# Altium schematic sheet Power_Section.SchDoc
size C
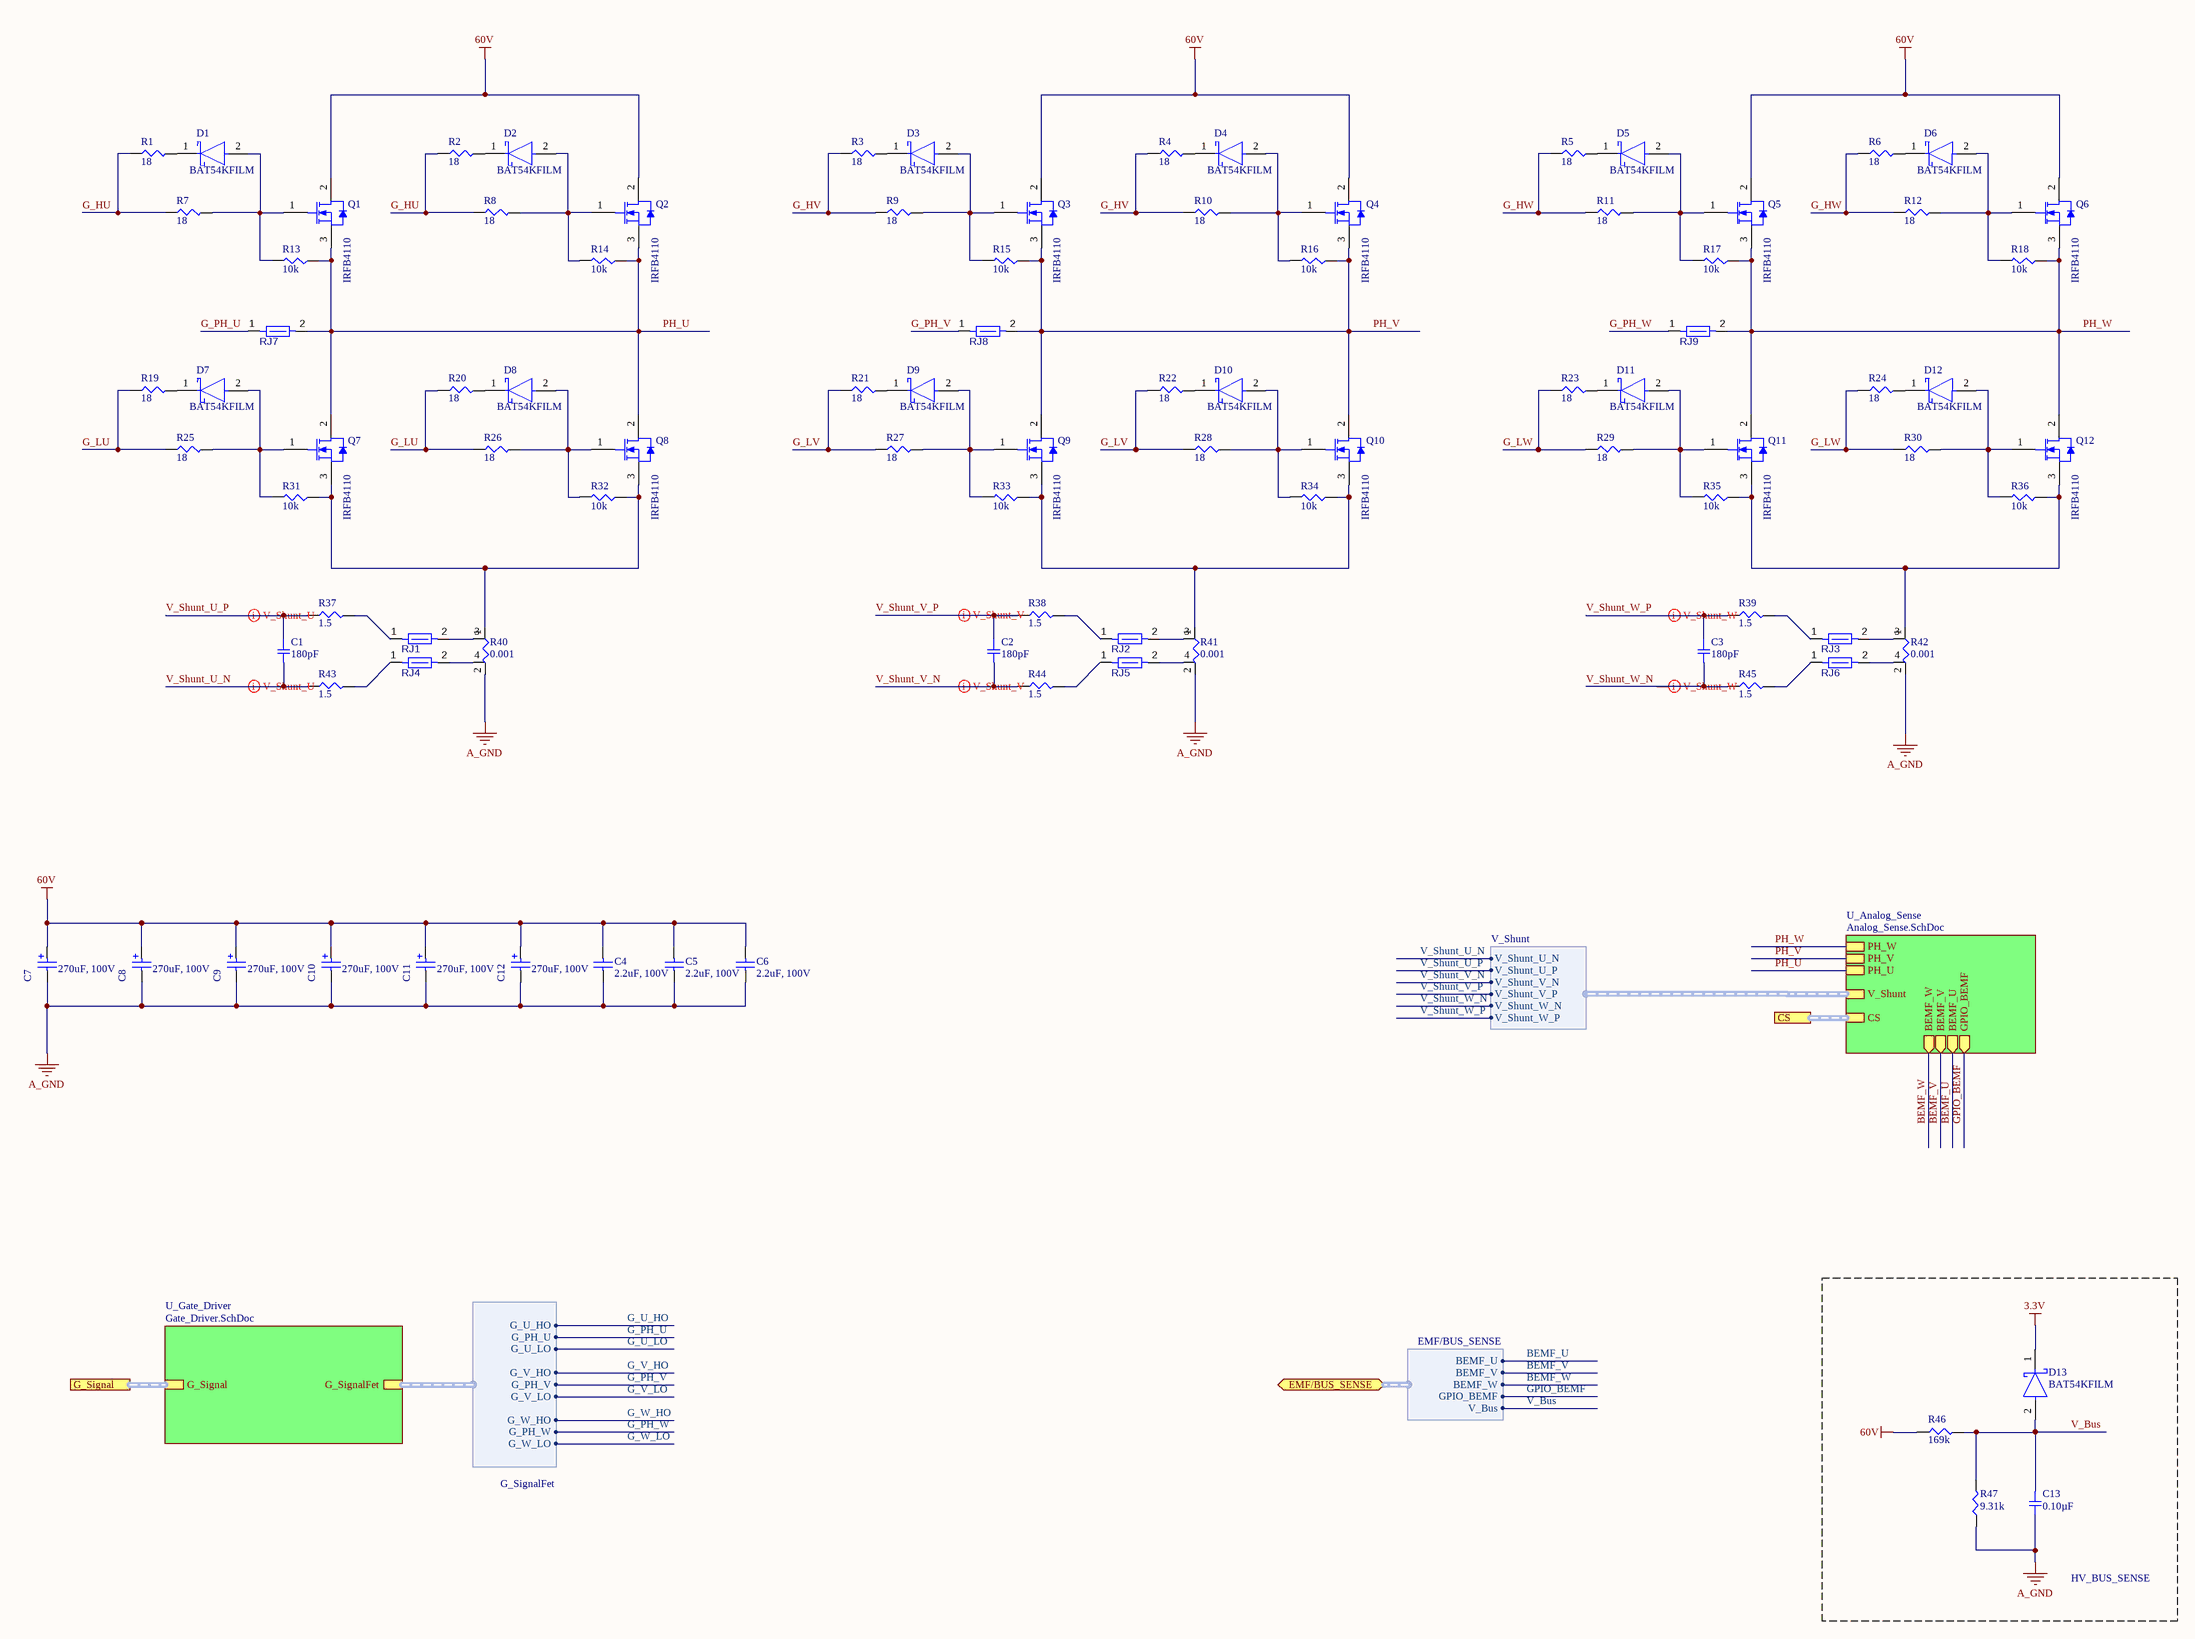
[diagram p0: Power_Section.SchDoc]

## Parts
C1  180pF  [SMD-0805C]
C2  180pF  [SMD-0805C]
C3  180pF  [SMD-0805C]
C4  2.2uF, 100V  [L18_W8.5_H15_P15]
C5  2.2uF, 100V  [L18_W8.5_H15_P15]
C6  2.2uF, 100V  [L18_W8.5_H15_P15]
C7  270uF, 100V  [WCAP-ATUL_16x25]
C8  270uF, 100V  [WCAP-ATUL_16x25]
C9  270uF, 100V  [WCAP-ATUL_16x25]
C10  270uF, 100V  [WCAP-ATUL_16x25]
C11  270uF, 100V  [WCAP-ATUL_16x25]
C12  270uF, 100V  [WCAP-ATUL_16x25]
C13  0.10µF  [SMD-0805C]
D1  BAT54KFILM  [FP-SOD-523-MFG]
D2  BAT54KFILM  [FP-SOD-523-MFG]
D3  BAT54KFILM  [FP-SOD-523-MFG]
D4  BAT54KFILM  [FP-SOD-523-MFG]
D5  BAT54KFILM  [FP-SOD-523-MFG]
D6  BAT54KFILM  [FP-SOD-523-MFG]
D7  BAT54KFILM  [FP-SOD-523-MFG]
D8  BAT54KFILM  [FP-SOD-523-MFG]
D9  BAT54KFILM  [FP-SOD-523-MFG]
D10  BAT54KFILM  [FP-SOD-523-MFG]
D11  BAT54KFILM  [FP-SOD-523-MFG]
D12  BAT54KFILM  [FP-SOD-523-MFG]
D13  BAT54KFILM  [FP-SOD-523-MFG]
Q1  IRFB4110  [TO-220-3_Horizontal_TabUp]
Q2  IRFB4110  [TO-220-3_Horizontal_TabUp]
Q3  IRFB4110  [TO-220-3_Horizontal_TabUp]
Q4  IRFB4110  [TO-220-3_Horizontal_TabUp]
Q5  IRFB4110  [TO-220-3_Horizontal_TabUp]
Q6  IRFB4110  [TO-220-3_Horizontal_TabUp]
Q7  IRFB4110  [TO-220-3_Horizontal_TabUp]
Q8  IRFB4110  [TO-220-3_Horizontal_TabUp]
Q9  IRFB4110  [TO-220-3_Horizontal_TabUp]
Q10  IRFB4110  [TO-220-3_Horizontal_TabUp]
Q11  IRFB4110  [TO-220-3_Horizontal_TabUp]
Q12  IRFB4110  [TO-220-3_Horizontal_TabUp]
R1  18  [SMD-0805-RES]
R2  18  [SMD-0805-RES]
R3  18  [SMD-0805-RES]
R4  18  [SMD-0805-RES]
R5  18  [SMD-0805-RES]
R6  18  [SMD-0805-RES]
R7  18  [SMD-0805-RES]
R8  18  [SMD-0805-RES]
R9  18  [SMD-0805-RES]
R10  18  [SMD-0805-RES]
R11  18  [SMD-0805-RES]
R12  18  [SMD-0805-RES]
R13  10k  [SMD-0805-RES]
R14  10k  [SMD-0805-RES]
R15  10k  [SMD-0805-RES]
R16  10k  [SMD-0805-RES]
R17  10k  [SMD-0805-RES]
R18  10k  [SMD-0805-RES]
R19  18  [SMD-0805-RES]
R20  18  [SMD-0805-RES]
R21  18  [SMD-0805-RES]
R22  18  [SMD-0805-RES]
R23  18  [SMD-0805-RES]
R24  18  [SMD-0805-RES]
R25  18  [SMD-0805-RES]
R26  18  [SMD-0805-RES]
R27  18  [SMD-0805-RES]
R28  18  [SMD-0805-RES]
R29  18  [SMD-0805-RES]
R30  18  [SMD-0805-RES]
R31  10k  [SMD-0805-RES]
R32  10k  [SMD-0805-RES]
R33  10k  [SMD-0805-RES]
R34  10k  [SMD-0805-RES]
R35  10k  [SMD-0805-RES]
R36  10k  [SMD-0805-RES]
R37  1.5  [SMD-0805-RES]
R38  1.5  [SMD-0805-RES]
R39  1.5  [SMD-0805-RES]
R40  0.001  [SMD-2512-RES]
R41  0.001  [SMD-2512-RES]
R42  0.001  [SMD-2512-RES]
R43  1.5  [SMD-0805-RES]
R44  1.5  [SMD-0805-RES]
R45  1.5  [SMD-0805-RES]
R46  169k  [SMD-0805-RES]
R47  9.31k  [SMD-0805-RES]
RJ1  Net Tie 12x8mil  [SHORT06-FP]  (value not drawn)  (net tie, no BOM)
RJ2  Net Tie 12x8mil  [SHORT06-FP]  (value not drawn)  (net tie, no BOM)
RJ3  Net Tie 12x8mil  [SHORT06-FP]  (value not drawn)  (net tie, no BOM)
RJ4  Net Tie 12x8mil  [SHORT06-FP]  (value not drawn)  (net tie, no BOM)
RJ5  Net Tie 12x8mil  [SHORT06-FP]  (value not drawn)  (net tie, no BOM)
RJ6  Net Tie 12x8mil  [SHORT06-FP]  (value not drawn)  (net tie, no BOM)
RJ7  Net Tie 12x8mil  [SHORT06-FP]  (value not drawn)  (net tie, no BOM)
RJ8  Net Tie 12x8mil  [SHORT06-FP]  (value not drawn)  (net tie, no BOM)
RJ9  Net Tie 12x8mil  [SHORT06-FP]  (value not drawn)  (net tie, no BOM)

## Blocks framed on the sheet
HV_BUS_SENSE: C13 D13 R46 R47

## Sub-sheets
U_Analog_Sense = Analog_Sense.SchDoc: PH_W, PH_U, PH_V, CS (harness CS), BEMF_W (out), BEMF_V (out), BEMF_U (out), GPIO_BEMF (out), V_Shunt (harness V_Shunt)
U_Gate_Driver = Gate_Driver.SchDoc: G_Signal (harness G_Signal), G_SignalFet (harness G_SignalFet)

## Ports
CS (harness CS), EMF/BUS_SENSE (bidir, harness EMF/BUS_SENSE), G_Signal (harness G_Signal)

## Harnesses
G_SignalFet: G_V_HO, G_PH_V, G_V_LO, G_PH_W, G_U_HO, G_PH_U, G_U_LO, G_W_HO, G_W_LO
EMF/BUS_SENSE: BEMF_U, BEMF_V, BEMF_W, GPIO_BEMF, V_Bus
V_Shunt: V_Shunt_U_N, V_Shunt_U_P, V_Shunt_V_N, V_Shunt_V_P, V_Shunt_W_N, V_Shunt_W_P

## Nets
3.3V: D13.1(C)
60V: C4.2 C5.2 C6.2 C7.2(P) C8.2(P) C9.2(P) C10.2(P) C11.2(P) C12.2(P) Q1.2(DRAIN) Q2.2(DRAIN) Q3.2(DRAIN) Q4.2(DRAIN) Q5.2(DRAIN) Q6.2(DRAIN) R46.1
A_GND: C4.1 C5.1 C6.1 C7.1(N) C8.1(N) C9.1(N) C10.1(N) C11.1(N) C12.1(N) C13.2 R40.2 R41.2 R42.2 R47.1
BEMF_U: sheet U_Analog_Sense/BEMF_U, port EMF/BUS_SENSE.BEMF_U
BEMF_V: sheet U_Analog_Sense/BEMF_V, port EMF/BUS_SENSE.BEMF_V
BEMF_W: sheet U_Analog_Sense/BEMF_W, port EMF/BUS_SENSE.BEMF_W
G_HU: R1.1 R2.1 R7.1 R8.1
G_HV: R3.1 R4.1 R9.1 R10.1
G_HW: R5.1 R6.1 R11.1 R12.1
G_LU: R19.1 R20.1 R25.1 R26.1
G_LV: R21.1 R22.1 R27.1 R28.1
G_LW: R23.1 R24.1 R29.1 R30.1
G_PH_U: RJ7.1 ; sheet U_Gate_Driver/G_SignalFet.G_PH_U
G_PH_V: RJ8.1 ; sheet U_Gate_Driver/G_SignalFet.G_PH_V
G_PH_W: RJ9.1 ; sheet U_Gate_Driver/G_SignalFet.G_PH_W
G_U_HO: sheet U_Gate_Driver/G_SignalFet.G_U_HO
G_U_LO: sheet U_Gate_Driver/G_SignalFet.G_U_LO
G_V_HO: sheet U_Gate_Driver/G_SignalFet.G_V_HO
G_V_LO: sheet U_Gate_Driver/G_SignalFet.G_V_LO
G_W_HO: sheet U_Gate_Driver/G_SignalFet.G_W_HO
G_W_LO: sheet U_Gate_Driver/G_SignalFet.G_W_LO
GPIO_BEMF: sheet U_Analog_Sense/GPIO_BEMF, port EMF/BUS_SENSE.GPIO_BEMF
PH_U: Q1.3(SOURCE) Q2.3(SOURCE) Q7.2(DRAIN) Q8.2(DRAIN) R13.1 R14.1 RJ7.2 ; sheet U_Analog_Sense/PH_U
PH_V: Q3.3(SOURCE) Q4.3(SOURCE) Q9.2(DRAIN) Q10.2(DRAIN) R15.1 R16.1 RJ8.2 ; sheet U_Analog_Sense/PH_V
PH_W: Q5.3(SOURCE) Q6.3(SOURCE) Q11.2(DRAIN) Q12.2(DRAIN) R17.1 R18.1 RJ9.2 ; sheet U_Analog_Sense/PH_W
V_Bus: C13.1 D13.2(A) R46.2 R47.2 ; port EMF/BUS_SENSE.V_Bus
V_Shunt_U_N: C1.2 R43.1 ; sheet U_Analog_Sense/V_Shunt.V_Shunt_U_N
V_Shunt_U_P: C1.1 R37.1 ; sheet U_Analog_Sense/V_Shunt.V_Shunt_U_P
V_Shunt_V_N: C2.2 R44.1 ; sheet U_Analog_Sense/V_Shunt.V_Shunt_V_N
V_Shunt_V_P: C2.1 R38.1 ; sheet U_Analog_Sense/V_Shunt.V_Shunt_V_P
V_Shunt_W_N: C3.2 R45.1 ; sheet U_Analog_Sense/V_Shunt.V_Shunt_W_N
V_Shunt_W_P: C3.1 R39.1 ; sheet U_Analog_Sense/V_Shunt.V_Shunt_W_P
NetD1_1: D1.1(C) R1.2
NetD1_2: D1.2(A) Q1.1(GATE) R7.2 R13.2
NetD2_1: D2.1(C) R2.2
NetD2_2: D2.2(A) Q2.1(GATE) R8.2 R14.2
NetD3_1: D3.1(C) R3.2
NetD3_2: D3.2(A) Q3.1(GATE) R9.2 R15.2
NetD4_1: D4.1(C) R4.2
NetD4_2: D4.2(A) Q4.1(GATE) R10.2 R16.2
NetD5_1: D5.1(C) R5.2
NetD5_2: D5.2(A) Q5.1(GATE) R11.2 R17.2
NetD6_1: D6.1(C) R6.2
NetD6_2: D6.2(A) Q6.1(GATE) R12.2 R18.2
NetD7_1: D7.1(C) R19.2
NetD7_2: D7.2(A) Q7.1(GATE) R25.2 R31.2
NetD8_1: D8.1(C) R20.2
NetD8_2: D8.2(A) Q8.1(GATE) R26.2 R32.2
NetD9_1: D9.1(C) R21.2
NetD9_2: D9.2(A) Q9.1(GATE) R27.2 R33.2
NetD10_1: D10.1(C) R22.2
NetD10_2: D10.2(A) Q10.1(GATE) R28.2 R34.2
NetD11_1: D11.1(C) R23.2
NetD11_2: D11.2(A) Q11.1(GATE) R29.2 R35.2
NetD12_1: D12.1(C) R24.2
NetD12_2: D12.2(A) Q12.1(GATE) R30.2 R36.2
NetQ7_3: Q7.3(SOURCE) Q8.3(SOURCE) R31.1 R32.1 R40.1
NetQ9_3: Q9.3(SOURCE) Q10.3(SOURCE) R33.1 R34.1 R41.1
NetQ11_3: Q11.3(SOURCE) Q12.3(SOURCE) R35.1 R36.1 R42.1
NetR37_2: R37.2 RJ1.1
NetR38_2: R38.2 RJ2.1
NetR39_2: R39.2 RJ3.1
NetR40_3: R40.3 RJ1.2
NetR40_4: R40.4 RJ4.2
NetR41_3: R41.3 RJ2.2
NetR41_4: R41.4 RJ5.2
NetR42_3: R42.3 RJ3.2
NetR42_4: R42.4 RJ6.2
NetR43_2: R43.2 RJ4.1
NetR44_2: R44.2 RJ5.1
NetR45_2: R45.2 RJ6.1

## Buses and harness runs
harness port CS = sheet U_Analog_Sense/CS
harness port G_Signal = sheet U_Gate_Driver/G_Signal

## Layout directives
differential pair: V_Shunt_U_N, V_Shunt_U_P, V_Shunt_V_N, V_Shunt_V_P, V_Shunt_W_N, V_Shunt_W_P

## Library data of the parts
C1-C3 = GQM2195C2A181GB12D: CAP CER 180PF 100V NP0 0805; Manufacturer: Murata Electronics North America; Factory Stock: 0; Unit Price (USD): 1.44; Minimum Quantity: 1; Tolerance: ±2%; Temperature Coefficient: C0G, NP0; Datasheets: http://www.murata.com/~/media/webrenewal/support/library/catalog/products/capacitor/mlcc/c02e.pdf; Image: //media.digikey.com/Renders/Murata%20Renders/0805(GxM9).jpg; Digi-Key Part Number: 490-7180-1-ND; Part Number: GQM2195C2A181GB12D; Quantity Available: 7523; @ qty: 0; Packaging: Cut Tape (CT); Series: GQM; Part Status: Active; Value: 180pF; Voltage: 100V; Operating Temperature: -55°C ~ 125°C; Features: High Q, Low Loss; Ratings: -; Applications: RF, Microwave, High Frequency; Mounting Type: Surface Mount, MLCC; Package / Case: 0805 (2012 Metric); Size / Dimension: 0.079" L x 0.049" W (2.01mm x 1.25mm); Height - Seated (Max): -; Thickness (Max): 0.037" (0.95mm); Lead Spacing: -; Lead Style: -
C4-C6 = 890263425004CS: WCAP-FTBE THT Film Capacitors, 2.2uF, 100VDC; Insulation Resistance: 3000Ohm x F; Dissipation Factor@100kHz: 5%; Dissipation Factor@1kHz: 1%; Dissipation Factor@10kHz: 1.6%; Pitch: 15mm; Rate of Voltage Rise: 9V/us; Technical Reference: MPSP015225K100DCPP45004; ComponentLink1Description: Manufacturer; ComponentLink1URL: http://www.we-online.de; ComponentLink2Description: Datasheet; ComponentLink2URL: https://katalog.we-online.com/pbs/datasheet/890263425004CS.pdf; Length: 18mm; Mounting Technology: THT; Packaging: Carton; Part Number: 890263425004CS; Operating Temperature: -40 to +85degC; Width: 8.5mm; Capacitance: 2.2uF; Height: 15mm; Rated Voltage: 100VDC; Publisher: Wurth Elektronik; Published Date: August 2019
C7-C12 = 860040880007: WCAP-ATUL THT Aluminum Electrolytic Capacitors, D16mm x L25mm, 270uF, +/-20%, 100VDC; Dissipation Factor: 9%; Endurance: 10000h; Leakage Current: 270uA; Ripple Current max.: 1480mA; Technical Reference: ATDK250271M100DSPAEK000; ComponentLink1Description: Manufacturer; ComponentLink1URL: http://www.we-online.de; ComponentLink2Description: Datasheet; ComponentLink2URL: https://katalog.we-online.com/pbs/datasheet/860040880007.pdf; Length: 25mm; Mounting Technology: THT; Operating Temperature: -40 to +105degC; Packaging: Ammo Pack; Published Date: August 2019; Capacitance: 270uF; Diameter: 16mm; Part Number: 860040880007; Publisher: Wurth Elektronik; Capacitance Tolerance: +/-20%; Rated Voltage: 100VDC
C13 = GCD21BR71H104KA01L: CAP CER 0.1UF 50V X7R 0805; Manufacturer: Murata Electronics North America; Factory Stock: 0; Unit Price (USD): 0.24; Minimum Quantity: 1; Tolerance: ±10%; Datasheets: http://www.murata.com/~/media/webrenewal/support/library/catalog/products/capacitor/mlcc/c03e.ashx; Image: //media.digikey.com/Renders/Murata%20Renders/0805%28GxM6%29.jpg; Digi-Key Part Number: 490-11955-1-ND; Part Number: GCD21BR71H104KA01L; Quantity Available: 157; @ qty: 0; Packaging: Cut Tape (CT); Series: GCD; Part Status: Active; Value: 0.10µF; Voltage: 50V; Temperature Coefficient: X7R; Operating Temperature: -55°C ~ 125°C; Features: -; Ratings: AEC-Q200; Applications: Automotive; Mounting Type: Surface Mount, MLCC; Package / Case: 0805 (2012 Metric); Size / Dimension: 0.079" L x 0.049" W (2.00mm x 1.25mm); Height - Seated (Max): -; Thickness (Max): 0.049" (1.25mm); Lead Spacing: -; Lead Style: -
D1-D13 = CMP-12187-000026-1: DIODE SCHOTTKY 40V 300MA SOD523; Manufacturer: STMicroelectronics; Capacitance: 7pF; Value: 7pF; Max Surge Forward Current: 1.25A; Peak Reverse Current: 1uA; Max Junction Temp: +150°C; Device Class L2: Diodes; Temperature Range Low: -40°C; Category: Diode; Manufacturer Part Number: BAT54KFILM; Digikey Description: DIODE SCHOTTKY 40V 300MA SOD523; Device Class L3: Schottky Diodes; Automotive: No; Height: 0.7mm; Octopart: https://octopart.com/bat54kfilm-stmicroelectronics-39618022; ComponentLink2Description: Datasheet; Temperature Range High: +150°C; Device Class L1: Discrete Semiconductors; Max Repetitive Reverse Voltage: 40V; RoHS: TRUE; Temperature: -40°C to +150°C; ComponentLink2URL: https://www.st.com/content/ccc/resource/technical/document/datasheet/07/50/54/f2/0d/ba/4a/79/CD00001322.pdf/files/CD00001322.pdf/jcr:content/translations/en.CD00001322.pdf; Lead Free: Yes; Forward Current: 300mA; Package: SOD-523; Mouser Description: Schottky Diodes & Rectifiers schottky diode
Q1-Q12 = CUSTOM-MOS: 100V 120A; PartNumber: IPW65R110CFDA; Manufacturer: Infineon; QG: 118Â nC; Green: TRUE; Ptot (max): 277.8Â W; VGS(th) (max): 4.5Â V; VDS (max): 650Â V; RthJA (max): 62Â K/W; IDpuls (max): 99.6Â A; RDS (on) (max): 110Â mOhm; VGS(th) (min): 3.5Â V; Rth: 0.45Â K/W; Packing: Tube; ID (max): 31.2Â A; Polarity: N; ComponentLink1Description: Manufacturer URL; ComponentLink3Description: Package Specification; DatasheetVersion: Rev. 2.0; PackageDescription: 3-Pin Plastic (Green) Transistor Single Outline Package, 15.94 x 20.95 mm Body, 5.44 mm Pitch; Halogen-free: available; Mounting Technology: Through Hole; PackageVersion: Rev. 03; ComponentLink2Description: Datasheet; ComponentLink3URL: http://www.infineon.com/cms/packages/Leaded_and_through-hole/P-PG-TO247/P-PG-TO247-3-44.html?__locale=en; ComponentLink2URL: http://www.infineon.com/dgdl/DS_IPX65R110CFDA_2_0.pdf?folderId=db3a3043163797a6011637d4bae7003b&fileId=db3a304336797ff90136ba7c820925a5; Technology: CoolMOS CFDA; PackageReference: PG-TO247-3-44; ComponentLink1URL: http://www.infineon.com/; RthJC (max): 0.45Â K/W
R1-R12 R19-R30 = ERJ-P06J180V: RES SMD 18 OHM 5% 1/2W 0805; Manufacturer: Panasonic Electronic Components; Factory Stock: 0; Unit Price (USD): 0.01839; @ qty: 1500; Minimum Quantity: 1; Power (Watts): 0.5W, 1/2W; Temperature Coefficient: ±300ppm/°C; Part Number: ERJ-P06J180V; Datasheets: https://industrial.panasonic.com/cdbs/www-data/pdf/RDA0000/AOA0000C243.pdf; Image: //media.digikey.com/Renders/Panasonic%20Renders/ERJ-0805%20Pkg.jpg; Digi-Key Part Number: P18ADCT-ND; Quantity Available: 114565; Packaging: Cut Tape (CT); Series: ERJ; Part Status: Active; Value: 18; Tolerance: ±5%; Composition: Thick Film; Features: Automotive AEC-Q200, Pulse Withstanding; Operating Temperature: -55°C ~ 155°C; Package / Case: 0805 (2012 Metric); Supplier Device Package: 0805; Size / Dimension: 0.079" L x 0.049" W (2.00mm x 1.25mm); Height - Seated (Max): 0.028" (0.70mm); Number of Terminations: 2; Failure Rate: -
R13-R18 R31-R36 = ERJ-6ENF1002V: RES SMD 10K OHM 1% 1/8W 0805; Manufacturer: Panasonic Electronic Components; Factory Stock: 0; Unit Price (USD): 0.00729; @ qty: 1500; Minimum Quantity: 1; Power (Watts): 0.125W, 1/8W; Temperature Coefficient: ±100ppm/°C; Part Number: ERJ-6ENF1002V; Datasheets: http://industrial.panasonic.com/www-cgi/jvcr13pz.cgi?E+PZ+3+AOA0002+ERJ6ENF1002V+7+WW; Image: //media.digikey.com/Renders/Panasonic%20Renders/ERJ-0805%20Pkg.jpg; Digi-Key Part Number: P10.0KCCT-ND; Quantity Available: 3985614; Packaging: Cut Tape (CT); Series: ERJ; Part Status: Active; Value: 10k; Tolerance: ±1%; Composition: Thick Film; Features: Automotive AEC-Q200; Operating Temperature: -55°C ~ 155°C; Package / Case: 0805 (2012 Metric); Supplier Device Package: 0805; Size / Dimension: 0.079" L x 0.049" W (2.00mm x 1.25mm); Height - Seated (Max): 0.028" (0.70mm); Number of Terminations: 2; Failure Rate: -
R37-R39 R43-R45 = ERJ-6BQF1R5V: RES SMD 1.5 OHM 1% 1/3W 0805; Manufacturer: Panasonic Electronic Components; Factory Stock: 0; Unit Price (USD): 0.07013; @ qty: 1500; Minimum Quantity: 1; Power (Watts): 0.333W, 1/3W; Temperature Coefficient: ±200ppm/°C; Part Number: ERJ-6BQF1R5V; Datasheets: https://industrial.panasonic.com/cdbs/www-data/pdf/RDA0000/AOA0000C239.pdf; Image: //media.digikey.com/Renders/Panasonic%20Renders/ERJ-0805%20Pkg.jpg; Digi-Key Part Number: P15992CT-ND; Quantity Available: 5905; Packaging: Cut Tape (CT); Series: ERJ; Part Status: Active; Value: 1.5; Tolerance: ±1%; Composition: Thick Film; Features: Automotive AEC-Q200, Current Sense; Operating Temperature: -55°C ~ 125°C; Package / Case: 0805 (2012 Metric); Supplier Device Package: 0805; Size / Dimension: 0.079" L x 0.049" W (2.00mm x 1.25mm); Height - Seated (Max): 0.028" (0.70mm); Number of Terminations: 2; Failure Rate: -
R40-R42 = ERJ-M1WTF1M0U: RES SMD 0.001 OHM 1% 1W 2512; Manufacturer: Panasonic Electronic Components; Factory Stock: 0; Unit Price (USD): 0.26384; @ qty: 1500; Minimum Quantity: 1; Temperature Coefficient: 250/ +450ppm/°C; Part Number: ERJ-M1WTF1M0U; Datasheets: http://industrial.panasonic.com/www-cgi/jvcr13pz.cgi?E+PZ+3+AOA0007+ERJM1WTF1M0U+7+WW; Image: //media.digikey.com/Renders/Panasonic%20Renders/ERJ-2512%20Pkg.jpg; Digi-Key Part Number: P1.0NDCT-ND; Quantity Available: 22959; Packaging: Cut Tape (CT); Series: ERJ; Part Status: Active; Value: 0.001; Tolerance: ±1%; Power (Watts): 1W; Composition: Metal Element; Features: Current Sense; Operating Temperature: -55°C ~ 170°C; Package / Case: 2512 (6432 Metric); Supplier Device Package: 2512; Size / Dimension: 0.252" L x 0.126" W (6.40mm x 3.20mm); Height - Seated (Max): 0.043" (1.10mm); Number of Terminations: 2; Failure Rate: -
R46 = ERJ-6ENF1693V: RES SMD 169K OHM 1% 1/8W 0805; Manufacturer: Panasonic Electronic Components; Factory Stock: 0; Unit Price (USD): 0.00729; @ qty: 1500; Minimum Quantity: 1; Power (Watts): 0.125W, 1/8W; Temperature Coefficient: ±100ppm/°C; Part Number: ERJ-6ENF1693V; Datasheets: http://industrial.panasonic.com/www-cgi/jvcr13pz.cgi?E+PZ+3+AOA0002+ERJ6ENF1693V+7+WW; Image: //media.digikey.com/Renders/Panasonic%20Renders/ERJ-0805%20Pkg.jpg; Digi-Key Part Number: P169KCCT-ND; Quantity Available: 4864; Packaging: Cut Tape (CT); Series: ERJ; Part Status: Active; Value: 169k; Tolerance: ±1%; Composition: Thick Film; Features: Automotive AEC-Q200; Operating Temperature: -55°C ~ 155°C; Package / Case: 0805 (2012 Metric); Supplier Device Package: 0805; Size / Dimension: 0.079" L x 0.049" W (2.00mm x 1.25mm); Height - Seated (Max): 0.028" (0.70mm); Number of Terminations: 2; Failure Rate: -
R47 = ERJ-6ENF9311V: RES SMD 9.31K OHM 1% 1/8W 0805; Manufacturer: Panasonic Electronic Components; Factory Stock: 0; Unit Price (USD): 0.00729; @ qty: 1500; Minimum Quantity: 1; Power (Watts): 0.125W, 1/8W; Temperature Coefficient: ±100ppm/°C; Part Number: ERJ-6ENF9311V; Datasheets: http://industrial.panasonic.com/www-cgi/jvcr13pz.cgi?E+PZ+3+AOA0002+ERJ6ENF9311V+7+WW; Image: //media.digikey.com/Renders/Panasonic%20Renders/ERJ-0805%20Pkg.jpg; Digi-Key Part Number: P9.31KCCT-ND; Quantity Available: 47337; Packaging: Cut Tape (CT); Series: ERJ; Part Status: Active; Value: 9.31k; Tolerance: ±1%; Composition: Thick Film; Features: Automotive AEC-Q200; Operating Temperature: -55°C ~ 155°C; Package / Case: 0805 (2012 Metric); Supplier Device Package: 0805; Size / Dimension: 0.079" L x 0.049" W (2.00mm x 1.25mm); Height - Seated (Max): 0.028" (0.70mm); Number of Terminations: 2; Failure Rate: -
RJ1-RJ9 = CMP-009-00121-1: Max Operating Temperature: 155°C; Min Operating Temperature: -55°C; Pins: 2